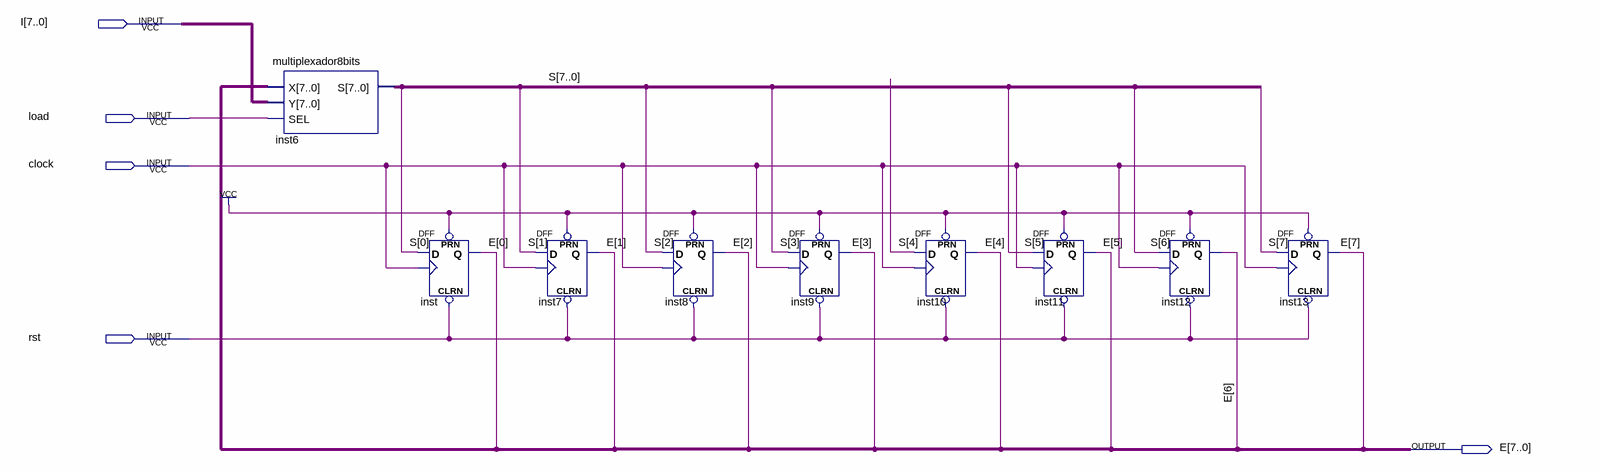
[diagram p0: schematic sheet]
// Quartus schematic registrador8bits.bdf as structural Verilog: 9 symbols, 5 pins
module registrador8bits (
  input  [7:0] I,
  input  load,
  input  clock,
  input  rst,
  output [7:0] E
);

  wire [7:0] S;

  multiplexador8bits inst6 (.X(E), .Y(I), .SEL(load), .S(S));
  DFF inst (.CLRN(rst), .CLK(clock), .D(S[0]), .PRN(1'b1), .Q(E[0]));
  DFF inst7 (.CLRN(rst), .CLK(clock), .D(S[1]), .PRN(1'b1), .Q(E[1]));
  DFF inst8 (.CLRN(rst), .CLK(clock), .D(S[2]), .PRN(1'b1), .Q(E[2]));
  DFF inst9 (.CLRN(rst), .CLK(clock), .D(S[3]), .PRN(1'b1), .Q(E[3]));
  DFF inst10 (.CLRN(rst), .CLK(clock), .D(S[4]), .PRN(1'b1), .Q(E[4]));
  DFF inst11 (.CLRN(rst), .CLK(clock), .D(S[5]), .PRN(1'b1), .Q(E[5]));
  DFF inst12 (.CLRN(rst), .CLK(clock), .D(S[6]), .PRN(1'b1), .Q(E[6]));
  DFF inst13 (.CLRN(rst), .CLK(clock), .D(S[7]), .PRN(1'b1), .Q(E[7]));
endmodule
